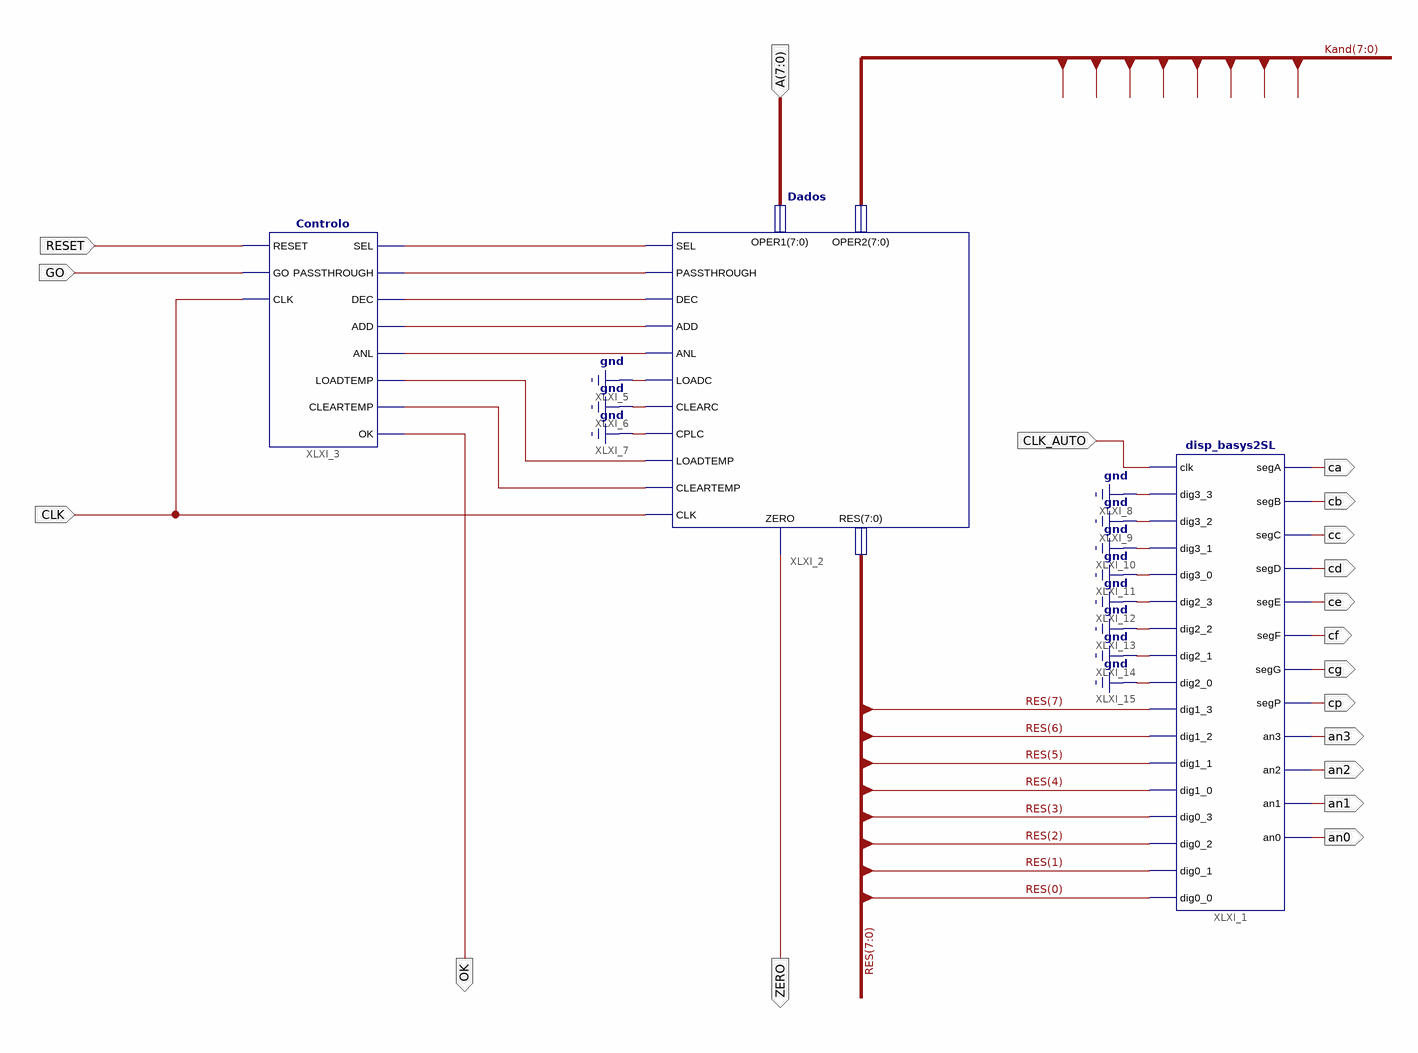
[diagram p0: schematic sheet 1]
// Xilinx ISE schematic Sistema.sch (spartan3e) as structural Verilog: 3 symbols, 19 ports
module Sistema (
  input  CLK_AUTO,
  input  [7:0] A,
  input  CLK,
  input  GO,
  input  RESET,
  output ca,
  output cb,
  output cc,
  output cd,
  output ce,
  output cf,
  output cg,
  output cp,
  output an3,
  output an2,
  output an1,
  output an0,
  output ZERO,
  output OK
);

  wire XLXN_56, XLXN_57, XLXN_58, XLXN_59, XLXN_60, XLXN_61, XLXN_62;
  wire [7:0] Kand, RES;

  Dados XLXI_2 (
    .ADD(XLXN_59), .ANL(XLXN_60), .CLEARC(1'b0), .CLEARTEMP(XLXN_62), .CLK(CLK), .CPLC(1'b0), .DEC(XLXN_58),
    .LOADC(1'b0), .LOADTEMP(XLXN_61), .PASSTHROUGH(XLXN_57), .SEL(XLXN_56), .OPER1(A), .OPER2(Kand),
    .ZERO(ZERO), .RES(RES));
  disp_basys2SL XLXI_1 (
    .clk(CLK_AUTO), .dig3_3(1'b0), .dig3_2(1'b0), .dig3_1(1'b0), .dig3_0(1'b0), .dig2_3(1'b0), .dig2_2(1'b0),
    .dig2_1(1'b0), .dig2_0(1'b0), .dig1_3(RES[7]), .dig1_2(RES[6]), .dig1_1(RES[5]), .dig1_0(RES[4]),
    .dig0_3(RES[3]), .dig0_2(RES[2]), .dig0_1(RES[1]), .dig0_0(RES[0]), .segA(ca), .segB(cb), .segC(cc),
    .segD(cd), .segE(ce), .segF(cf), .segG(cg), .segP(cp), .an3(an3), .an2(an2), .an1(an1), .an0(an0));
  Controlo XLXI_3 (
    .ADD(XLXN_59), .ANL(XLXN_60), .CLEARTEMP(XLXN_62), .CLK(CLK), .DEC(XLXN_58), .GO(GO), .LOADTEMP(XLXN_61),
    .OK(OK), .PASSTHROUGH(XLXN_57), .RESET(RESET), .SEL(XLXN_56));
endmodule
